# EAGLE design RFUSBtoDB15Adapter (EAGLE 9.5.1)
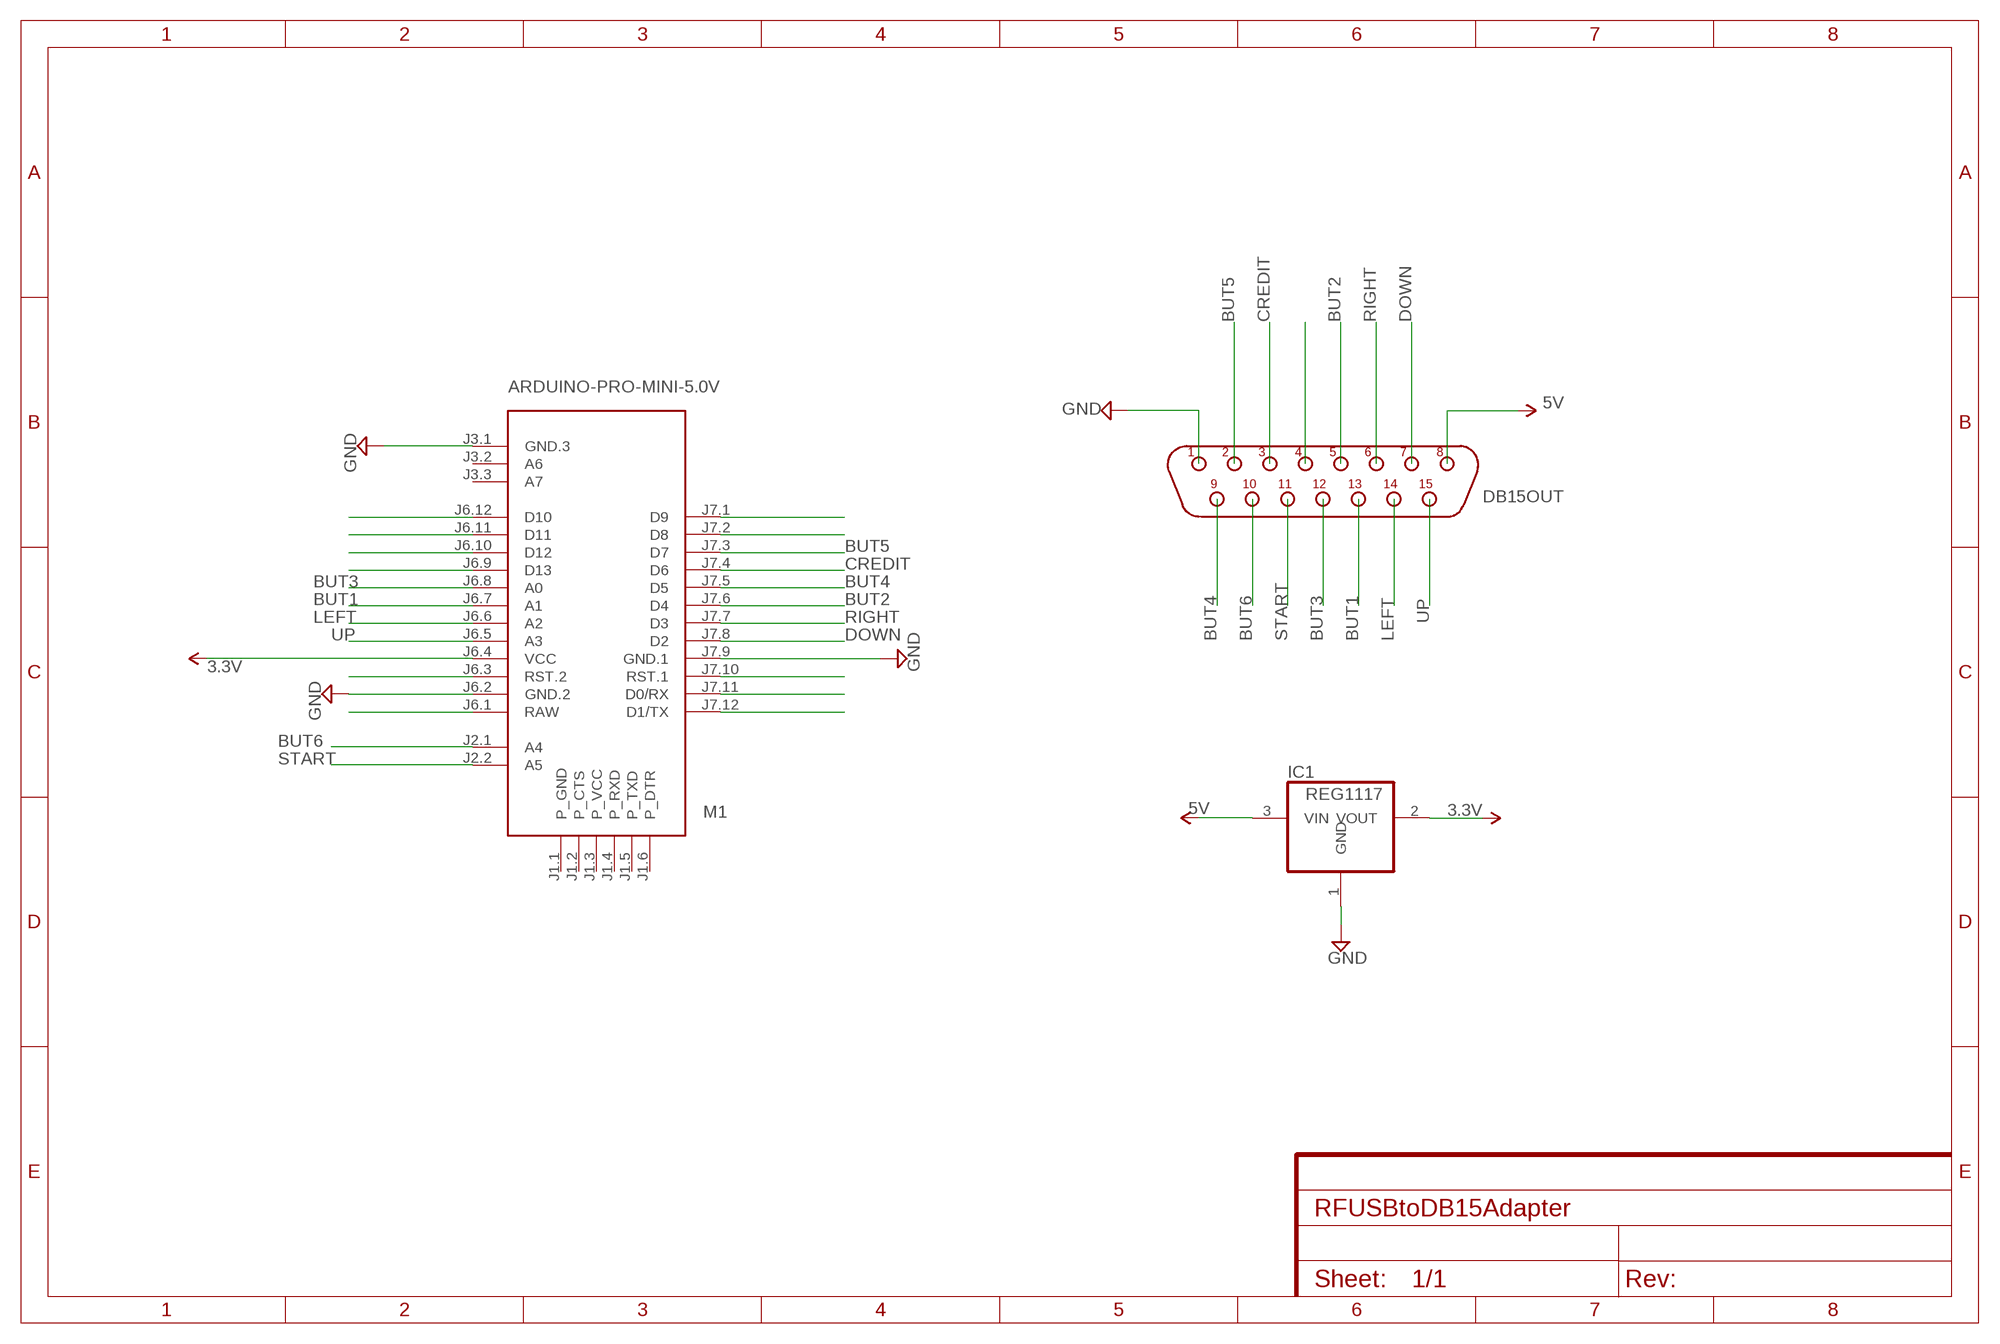
[diagram p0: schematic, sheet 1]

## Parts
DB15OUT  DB15M/90  [D-15M/90]
IC1  REG1117  [SOT223]
M1  ARDUINO-PRO-MINI-5.0V  [ARDUINO-PRO-MINI]

## Nets
3.3V: IC1.2(VOUT) M1.J6.4(VCC)
5V: DB15OUT.8 IC1.3(VIN)
BUT1: DB15OUT.13 M1.J6.7(A1)
BUT2: DB15OUT.5 M1.J7.6(D4)
BUT3: DB15OUT.12 M1.J6.8(A0)
BUT4: DB15OUT.9 M1.J7.5(D5)
BUT5: DB15OUT.2 M1.J7.3(D7)
BUT6: DB15OUT.10 M1.J2.1(A4)
CREDIT: DB15OUT.3 M1.J7.4(D6)
DOWN: DB15OUT.7 M1.J7.8(D2)
GND: DB15OUT.1 IC1.1(GND) M1.J3.1(GND.3) M1.J6.2(GND.2) M1.J7.9(GND.1)
LEFT: DB15OUT.14 M1.J6.6(A2)
N$4: M1.J7.2(D8)
N$5: M1.J7.1(D9)
N$9: M1.J6.12(D10)
N$10: M1.J6.11(D11)
N$11: M1.J6.10(D12)
N$12: M1.J6.9(D13)
N$14: DB15OUT.4
N$19: M1.J6.3(RST.2)
N$21: M1.J6.1(RAW)
N$22: M1.J7.10(RST.1)
N$23: M1.J7.11(D0/RX)
N$24: M1.J7.12(D1/TX)
RIGHT: DB15OUT.6 M1.J7.7(D3)
START: DB15OUT.11 M1.J2.2(A5)
UP: DB15OUT.15 M1.J6.5(A3)
Unconnected: M1.J1.1(P_GND) M1.J1.2(P_CTS) M1.J1.3(P_VCC) M1.J1.4(P_RXD) M1.J1.5(P_TXD) M1.J1.6(P_DTR) M1.J3.2(A6) M1.J3.3(A7)

## Library data of the parts
DB15OUT = dbconnector:DB15M/90
IC1 = burr-brown:REG1117: 800mA and 1A Low Dropout (LDO) Positive Regulator 1.8V, 2.5V, 2.85V, 3.3V, 5V, and Adj; MPN: REG1117; OC_FARNELL: 1097566; OC_NEWARK: 14P6981
M1 = Arduino:ARDUINO-PRO-MINI-*: Arduino Pro Mini and compatible devices More details available here: https://www.arduino.cc/en/Main/ArduinoBoardProMini Click here to find device on ebay.com <http://www.ebay.com/sch/arduino+pro+mini>

## Board
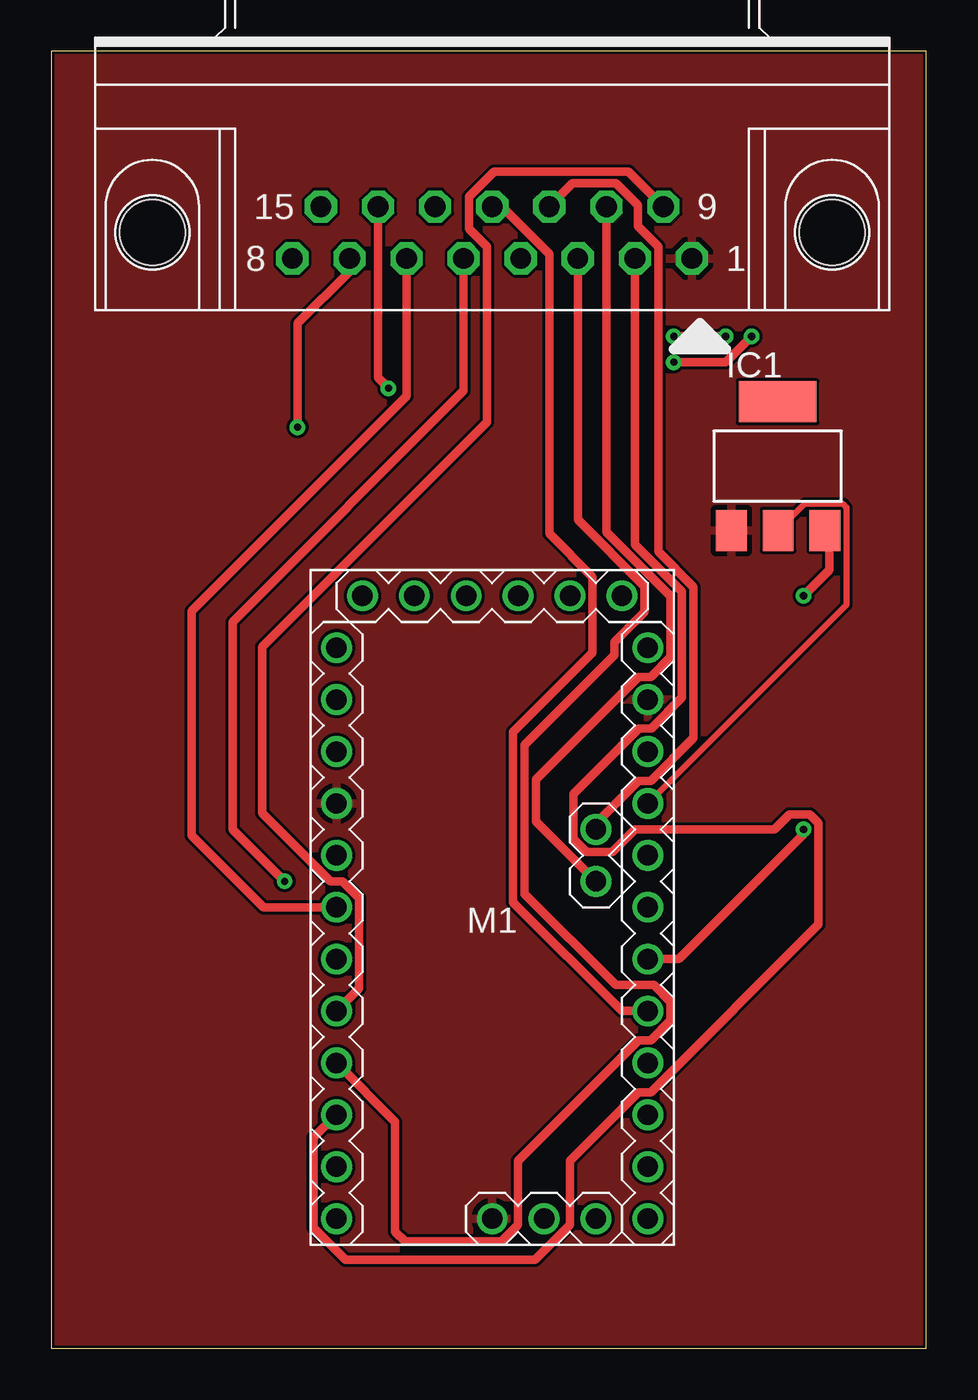
[diagram p1: board, top side]
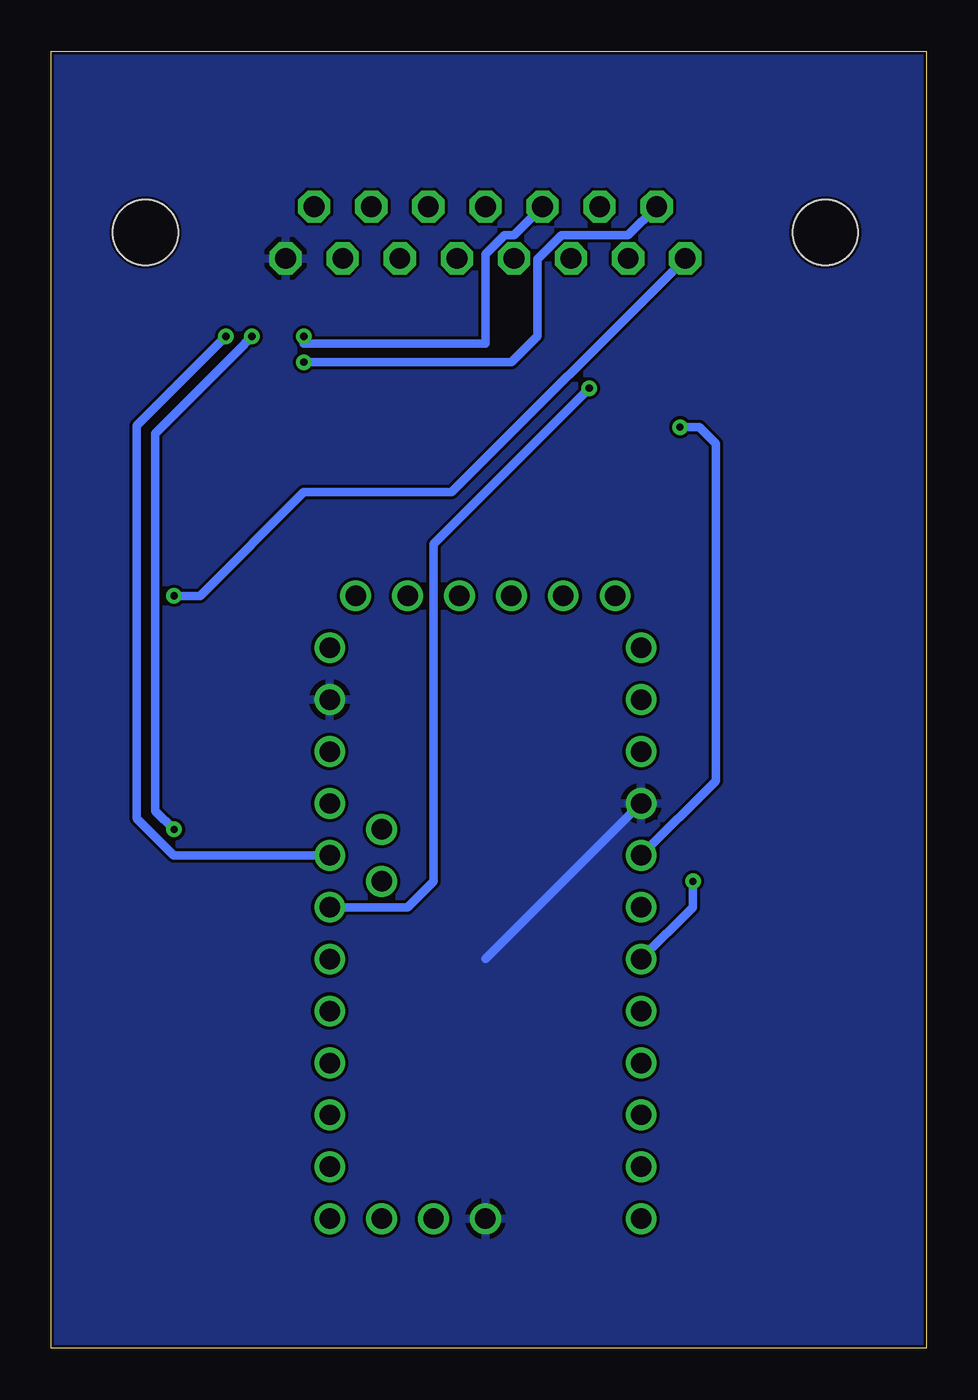
[diagram p2: board, bottom side, seen from below]

Size 42.85 x 63.49 mm. Coordinates in mm from the lower left corner, seen from the top.
Outline: 0,0 42.85,0 42.85,63.49 0,63.49 0,0
Copper layers (1*16): Top 0.035mm / dielectric 1.5mm / Bottom 0.035mm
Design rules "default *": minimum track width 8mil, minimum drill 0.35mm, track to track 6mil, track to pad 6mil, pad to pad 6mil, via to via 6mil, smd to smd 6mil, copper to edge 6mil, drill to drill 6mil, minimum pad ring 10mil, minimum via ring 8mil, stop-mask expansion 4mil, vias tented up to drill 0mil, thermal gap 10mil

### Footprints (pad centres in the part's own frame; a part is rotated, then mirrored left to right if it is on the bottom)
D-15M/90 = drill 1.016 pad 1.575 octagon: 1 9.779,-1.27; 2 6.985,-1.27; 3 4.191,-1.27; 4 1.397,-1.27; 5 -1.397,-1.27; 6 -4.191,-1.27; 7 -6.985,-1.27; 8 -9.779,-1.27; 9 8.382,1.27; 10 5.588,1.27; 11 2.794,1.27; 12 0,1.27; 13 -2.794,1.27; 14 -5.588,1.27; 15 -8.382,1.27 | hole 3.2: 16.637,0; -16.637,0
SOT223 = smd 1.499 x 2.007: 1 -2.261,-3.15; 2 0.025,-3.15; 3 2.311,-3.15 | smd 3.81 x 2.007: 4 0,3.15
ARDUINO-PRO-MINI = drill 1: J1.1 -15.24,6.35; J1.2 -15.24,3.81; J1.3 -15.24,1.27; J1.4 -15.24,-1.27; J1.5 -15.24,-3.81; J1.6 -15.24,-6.35; J2.1 -1.27,5.08; J2.2 -3.81,5.08; J3.1 15.24,0; J3.2 15.24,2.54; J3.3 15.24,5.08; J6.1 -12.7,7.62; J6.2 -10.16,7.62; J6.3 -7.62,7.62; J6.4 -5.08,7.62; J6.5 -2.54,7.62; J6.6 0,7.62; J6.7 2.54,7.62; J6.8 5.08,7.62; J6.9 7.62,7.62; J6.10 10.16,7.62; J6.11 12.7,7.62; J6.12 15.24,7.62; J7.1 15.24,-7.62; J7.2 12.7,-7.62; J7.3 10.16,-7.62; J7.4 7.62,-7.62; J7.5 5.08,-7.62; J7.6 2.54,-7.62; J7.7 0,-7.62; J7.8 -2.54,-7.62; J7.9 -5.08,-7.62; J7.10 -7.62,-7.62; J7.11 -10.16,-7.62; J7.12 -12.7,-7.62

### Placement (x,y rotation side)
DB15OUT  21.59,54.61 0 top
IC1  35.56,43.18 0 top
M1  21.59,21.59 270 top

### Tracks (layer width: path | path; a pad name or v marks a point on that pad's centre or on a via)
3.3V
  Top 0.305: IC1.2 36.89,41.34 38.75,41.34 38.92,41.16 38.92,36.39 M1.J6.4
5V  (via drill 0.35)
  Top 0.406: v36.83,36.83 38.1,38.1 38.1,39.8 IC1.3
  Bottom 0.406: v36.83,36.83 35.56,36.83 30.48,41.91 23.24,41.91 DB15OUT.8
BUT1  (via drill 0.35)
  Top 0.406: v30.48,49.53 v33.02,49.53 | v36.83,25.4 36.83,25.14 30.73,19.05 M1.J6.7
  Bottom 0.406: DB15OUT.13 20.19,54.48 20.67,54.48 21.59,53.56 21.59,49.17 30.48,49.17 v30.48,49.53 | v33.02,49.53 33.38,49.17 33.38,49.15 37.74,44.78 37.74,26.31 v36.83,25.4
BUT2  (via drill 0.35)
  Top 0.406: DB15OUT.5 20.19,46.86 8.89,35.56 8.89,25.4 v11.43,22.86
  Bottom 0.406: v11.43,22.86 11.43,21.59 M1.J7.6
BUT3
  Top 0.406: DB15OUT.12 22.06,55.88 24.38,53.56 24.38,39.87 26.51,37.75 26.51,34.06 22.61,30.17 22.61,21.84 27.94,16.51 M1.J6.8
BUT4
  Top 0.406: DB15OUT.9 28.27,57.58 21.68,57.58 20.45,56.35 20.45,54.81 21.34,53.92 21.34,45.34 10.32,34.32 10.32,26.21 13.67,22.86 14.27,22.86 15.08,22.05 15.08,17.62 M1.J7.5
BUT5
  Top 0.406: DB15OUT.2 28.57,39.34 30.88,37.04 30.88,31.85 29.37,30.34 28.78,30.34 25.56,27.13 25.56,24.94 26.21,24.29 27.46,24.29 28.57,25.4 35.4,25.4 36.14,26.13 37.13,26.13 37.56,25.7 37.56,20.75 29.35,12.54 28.75,12.54 25.4,9.19 25.4,6.05 23.68,4.33 14.43,4.33 12.86,5.89 12.86,10.32 M1.J7.3
BUT6
  Top 0.406: DB15OUT.10 27.18,39.95 30.32,36.81 30.32,33.83 29.35,32.86 28.75,32.86 23.73,27.84 23.73,25.8 M1.J2.1
CREDIT
  Top 0.406: DB15OUT.3 25.78,40.56 29.05,37.29 29.05,36.03 27.58,34.57 27.58,33.93 23.17,29.52 23.17,22.25 27.64,17.78 29.51,17.78 30.32,16.97 30.32,16.05 29.35,15.08 28.75,15.08 22.86,9.19 22.86,6.05 22.05,5.24 17.32,5.24 16.85,5.71 16.85,11.09 M1.J7.4
DOWN  (via drill 0.35)
  Top 0.406: DB15OUT.7 14.61,52.7 12.07,50.16 v12.07,45.08
  Bottom 0.406: M1.J7.8 10.32,27.78 10.32,44.29 11.12,45.08 v12.07,45.08
GND
  Bottom 0.406: M1.J7.9 21.59,19.05
  pour Bottom: 0,63.5 0,0 43.18,0 43.18,63.5
  pour Top: 0,63.5 0,0 43.18,0 43.18,63.5
LEFT  (via drill 0.35)
  Top 0.406: DB15OUT.14 16,47.5 v16.51,46.99
  Bottom 0.406: v16.51,46.99 24.13,39.37 24.13,22.86 25.4,21.59 M1.J6.6
RIGHT
  Top 0.406: DB15OUT.6 17.4,46.61 6.89,36.1 6.89,25.1 10.39,21.59 M1.J7.7
START
  Top 0.406: DB15OUT.11 25.53,57.02 27.65,57.02 28.72,55.96 28.72,54.92 29.72,53.92 29.72,38.99 31.44,37.27 31.44,29.87 29.35,27.78 28.75,27.78 26.67,25.7 M1.J2.2
UP  (via drill 0.35)
  Top 0.406: v30.48,48.26 33.02,48.26 v34.29,49.53
  Bottom 0.406: DB15OUT.15 14.61,54.48 17.87,54.48 19.01,53.34 19.05,53.34 19.05,49.53 20.32,48.26 v30.48,48.26 | v34.29,49.53 38.66,45.16 38.66,25.94 36.85,24.13 M1.J6.5